# Altium project TrainingBoard_Dimmer_v1.0.PrjPcb
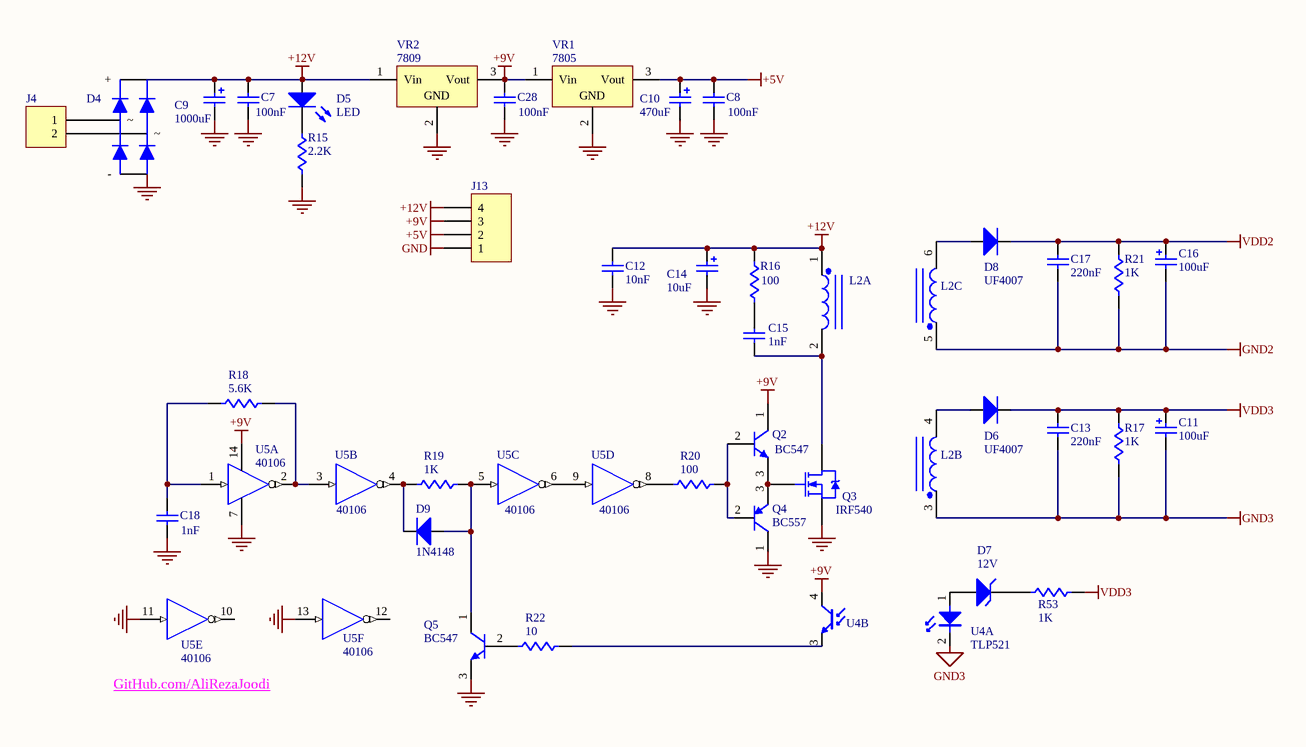
[diagram p0: Power Supply.SchDoc]
8 sheets, 63 parts. Net scope: flat (ports and power ports of the same name join across sheets).
Board file: PCB.PcbDoc
Sheets:
  Power Supply.SchDoc
  Key_Reset.SchDoc
  AVCC.SchDoc
  Programer Connectors_SPI.SchDoc
  Sounder_Buzzer.SchDoc
  Display_LCD16x2.SchDoc
  LM35.SchDoc
  PWM to DC.SchDoc

## Sheet Power Supply.SchDoc
size 241 x 134 mm; PageSetup: Record=PageOptions|CenterHorizontal=True|CenterVertical=True|PrintScale=0.71|XCorrection=1.00|YCorrection=1.00|PrintKind=1|BorderSize=5000000|LeftOffset=0|BottomOffset=0|Orientation=2|PaperLength=1000|PaperWidth=1000|Scale=100|PaperSource=15|PrintQuality=4000|MediaType=1|DitherType=10|PrintScaleMode=1|PaperKind=A4|PaperIndex=9

### Parts
(Parts that share a designator on the sheet are numbered #1, #2 ... from top to bottom, then left to right.)
C7  value 100nF  [CAPNTO2.54-3.05x1.78A]  (hidden comment: Cap)
C8  value 100nF  [CAPNTO2.54-3.05x1.78A]  (hidden comment: Cap)
C9  value 1000uF  [CAPPR5-10x12.5]  (hidden comment: Cap Pol1)
C10  value 470uF  [CAPPR5-10x12.5]  (hidden comment: Cap Pol1)
C11  value 100uF  [CAPPR2.5-6.3x5]  (hidden comment: Cap Pol1)
C12  value 10nF  [CAPNTO2.54-3.05x1.78A]  (hidden comment: Cap)
C13  value 220nF  [CAPNTO5.08-7.37x3.94]  (hidden comment: Cap)
C14  value 10uF  [CAPPR2.5-6.3x5]  (hidden comment: Cap Pol1)
C15  value 1nF  [CAPNTO2.54-3.56x2.03]  (hidden comment: Cap)
C16  value 100uF  [CAPPR2.5-6.3x5]  (hidden comment: Cap Pol1)
C17#1  value 220nF  [CAPNTO5.08-7.37x3.94]  (hidden comment: Cap)
C18  value 1nF  [CAPNTO2.54-3.05x1.78A]  (hidden comment: Cap)
C28  value 100nF  [CAPNTO2.54-3.05x1.78A]  (hidden comment: Cap)
D4  Bridge_1  [KBP]  (value not drawn)
D5  LED  [LED-5mm_Red]
D6  UF4007  [DIODE-0.4]
D7  value 12V  [DIODE-0.4]  (hidden comment: D Zener)
D8  UF4007  [DIODE-0.4]
D9  1N4148  [DIODE-0.4]
J4  Header 2  [Fonics_2PIN_1]  (value not drawn)
J13  Header 4  [Fonics_4PIN_1]  (value not drawn)
L2  Inductor 3  [INDUCTOR3]  (value not drawn)  (parts A,B,C of 3)
Q2  Device: BC547  [TO92C]  (hidden comment: NPN)
Q3  IRF540  [TO220V]
Q4  BC557  [TO92C]
Q5  value BC547  [TO92C]  (hidden comment: NPN)
R15  value 2.2K  [AXIAL-0.4]  (hidden comment: Res1)
R16  value 100  [AXIAL-0.4]  (hidden comment: Res1)
R17  value 1K  [AXIAL-0.4]  (hidden comment: Res1)
R18  value 5.6K  [AXIAL-0.4]  (hidden comment: Res1)
R19  value 1K  [AXIAL-0.4]  (hidden comment: Res1)
R20  value 100  [AXIAL-0.4]  (hidden comment: Res1)
R21  value 1K  [AXIAL-0.4]  (hidden comment: Res1)
R22  value 10  [AXIAL-0.4]  (hidden comment: Res1)
R53  value 1K  [AXIAL-0.4]  (hidden comment: Res1)
U4  value TLP521  [DIP-4]  (hidden comment: Optoisolator)  (parts A,B of 2)
U5  value 40106  [DIP14]  (hidden comment: U?)  (parts A,B,C,D,E,F of 6)
VR1  value 7805  [TO220V]  (hidden comment: Volt Reg)
VR2  value 7809  [TO220V]  (hidden comment: Volt Reg)

### Nets
+5V: C8.2 C10.1 J13.2 VR1.3(Vout)
+9V: C28.2 J13.3 Q2.1(C) U4.4(C) U5.14(VDD) VR1.1(Vin) VR2.3(Vout)
+12V: C7.2 C9.1 C12.2 C14.1 D4.3(+) D5.1(A) J13.4 L2.1 R16.1 VR2.1(Vin)
GND: C7.1 C8.1 C9.2 C10.2 C12.1 C14.2 C18.1 C28.1 D4.1(-) J13.1 Q3.3(S) Q4.1(C) Q5.3(E) R15.2 U5.7(VSS) U5.11(I) U5.13(I) VR1.2(GND) VR2.2(GND)
GND2: C16.2 C17#1.1 L2.5 R21.2
GND3: C11.2 C13.1 L2.3 R17.2 U4.2(K)
VDD2: C16.1 C17#1.2 D8.2(K) R21.1
VDD3: C11.1 C13.2 D6.2(K) R17.1 R53.1
NetC15_1: C15.1 L2.2 Q3.2(D)
NetC15_2: C15.2 R16.2
NetC18_2: C18.2 R18.2 U5.1(I)
NetD4_2: D4.2 J4.2
NetD4_4: D4.4 J4.1
NetD5_2: D5.2(K) R15.1
NetD6_1: D6.1(A) L2.4
NetD7_1: D7.1(A) U4.1(A)
NetD7_2: D7.2(K) R53.2
NetD8_1: D8.1(A) L2.6
NetD9_1: D9.1(A) Q5.1(C) R19.1 U5.5(I)
NetD9_2: D9.2(K) R19.2 U5.4(~{O})
NetQ2_2: Q2.2(B) Q4.2(B) R20.2
NetQ2_3: Q2.3(E) Q3.1(G) Q4.3(E)
NetQ5_2: Q5.2(B) R22.1
NetR18_1: R18.1 U5.2(~{O}) U5.3(I)
NetR20_1: R20.1 U5.8(~{O})
NetR22_2: R22.2 U4.3(E)
NetU5_6: U5.6(~{O}) U5.9(I)

Not connected (* = marked no-connect by the designer): U5 10(~{O}) 12(~{O})

### Notes on the sheet
- GitHub.com/AliRezaJoodi

### Library data of the parts
C7 C8 C12 C13 C15 C17#1 C18 C28 = Cap: Capacitor; Manufacturer: Generic Components; Class I: Passive; Published: 8-Jun-2000; Revision: July-2002: Re-released for DXP Platform.; Publisher: Altium Limited; Class II: Capacitor
C9-C11 C14 C16 = Cap Pol1: Polarized Capacitor (Radial); Manufacturer: Generic Components; Class I: Passive; Published: 8-Jun-2000; Revision: July-2002: Re-released for DXP Platform.; Publisher: Altium Limited; Class II: Capacitor
D4 = Bridge_1: Full Wave Diode Bridge; Manufacturer: Generic Components; Class I: Discrete; Class II: Rectifier - Bridge; Published: 8-Jun-2000; Revision: July-2002: Re-released for DXP Platform.; Publisher: Altium Limited
D5 = LED: Typical INFRARED GaAs LED; Manufacturer: Generic Components; Class I: Optoelectronic; Published: 8-Jun-2000; Revision: July-2002: Re-released for DXP Platform.; Publisher: Altium Limited; Class II: LED
D6 D8 D9 = Diode: Default Diode; Manufacturer: Generic Components; Class I: Discrete; Class II: Diode - Switching; Published: 8-Jun-2000; Revision: July-2002: Re-released for DXP Platform.; Publisher: Altium Limited
D7 = D Zener: Zener Diode; Manufacturer: Generic Components; Class I: Discrete; Class II: Diode - Zener; Published: 8-Jun-2000; Revision: July-2002: Re-released for DXP Platform.; Publisher: Altium Limited
J4 = Header 2: Header, 2-Pin; LatestRevisionDate: 17-Jul-2002; LatestRevisionNote: Re-released for DXP Platform.; Publisher: Altium Limited
J13 = Header 4: Header, 4-Pin; Manufacturer: Generic Components; Class I: Connector; Revision: July-2002: Re-released for DXP Platform.; Publisher: Altium Limited
Q2 = NPN: Silicon Bipolar Transistor; Package Reference: TO-92A
Q3 = IRFP141: 31A, 80V, 0.077 Ohm, N-Channel Power MOSFET; Note: Pin 2 (drain) is electrically connected to the case metal; Published: 8-Jun-2000; LatestRevisionDate: 17-Jul-2002; LatestRevisionNote: Re-released for DXP Platform.; DatasheetVersion: Jan-1998; PackageVersion: 1994; PackageReference: TO-247; Publisher: Altium Limited; PackageDescription: SIP with Mounting Hole; 3 Leads; Body 20.6 x 15.6 x 4.7 mm (typ); Pitch 5.56 mm; ComponentLink1Description: Manufacturer Link; ComponentLink1URL: http://www.intersil.com/cda/home/
Q4 = PNP: PNP Bipolar Transistor; Manufacturer: Generic Components; Class I: Discrete; Class II: BJT - Low Power; Published: 8-Jun-2000; Revision: July-2002: Re-released for DXP Platform.; Publisher: Altium Limited
Q5 = NPN: NPN Bipolar Transistor; Manufacturer: Generic Components; Class I: Discrete; Class II: BJT - Low Power; Published: 8-Jun-2000; Revision: July-2002: Re-released for DXP Platform.; Publisher: Altium Limited
R15-R22 R53 = Res1: Resistor; Manufacturer: Generic Components; Class I: Passive; Published: 8-Jun-2000; Revision: July-2002: Re-released for DXP Platform.; Publisher: Altium Limited; Class II: Resistor
U5 = 40106: Hex inverting Schmitt trigger, 14-Pin; Publisher: Altium Limited; ComponentLink1URL: http://www.nxp.com
VR1 VR2 = Volt Reg: Voltage Regulator; Manufacturer: Generic Components; Class I: Power Management; Published: 24-Mar-1999; Revision: July-2002: Re-released for DXP Platform.; Publisher: Altium Limited; Class II: Voltage Regulator
L2 = Inductor 3: Publisher: Altium Limited
U4 = Optoisolator: Publisher: Altium Limited

## Sheet Key_Reset.SchDoc
size 53 x 33 mm
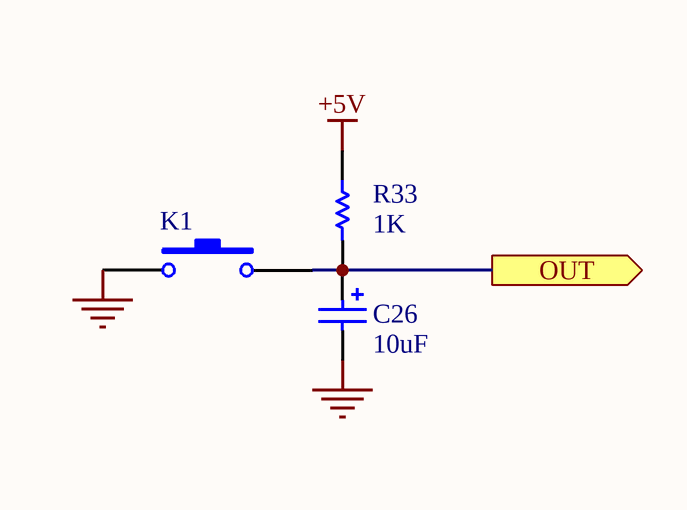
[diagram p1: Key_Reset.SchDoc]

### Parts
C26  value 10uF  [CAPPR2.5-6.3x5]  (hidden comment: Cap Pol1)
K1  SW-PB  [SPST-2_2]  (value not drawn)
R33  value 1K  [AXIAL-0.4]  (hidden comment: Res1)

### Ports
OUT (out)

### Nets
+5V: R33.1
GND: C26.2 K1.1
NetC1_1: C26.1 K1.2 R33.2 ; port OUT

### Library data of the parts
C26 = Cap Pol1: as C9 on sheet Power Supply; Published: 8-Jun-2000; Revision: July-2002: Re-released for DXP Platform.; Publisher: Altium Limited; Class II: Capacitor
K1 = SW-PB: Switch; Manufacturer: Generic Components; Published: 24-Mar-1999; Revision: July-2002: Re-released for DXP Platform.; Publisher: Altium Limited
R33 = Res1: as R15 on sheet Power Supply; Published: 8-Jun-2000; Revision: July-2002: Re-released for DXP Platform.; Publisher: Altium Limited; Class II: Resistor

## Sheet AVCC.SchDoc
size 60 x 25 mm
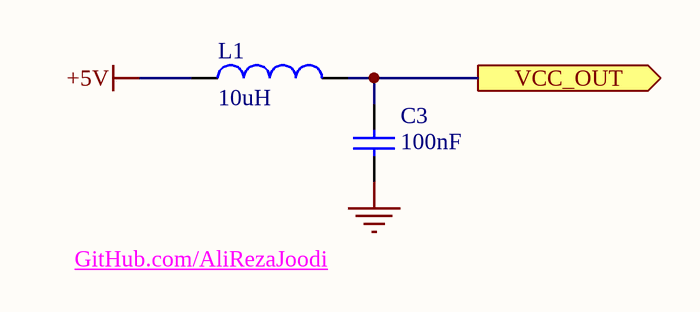
[diagram p2: AVCC.SchDoc]

### Parts
C3  value 100nF  [CAPNTO2.54-3.05x1.78A]  (hidden comment: Cap)
L1  value 10uH  [Inductor_1]  (hidden comment: Inductor)

### Ports
VCC_OUT (out)

### Nets
+5V: L1.1
GND: C3.2
NetC3_1: C3.1 L1.2 ; port VCC_OUT

### Notes on the sheet
- (near C3) GitHub.com/AliRezaJoodi

### Library data of the parts
C3 = Cap: as C7 on sheet Power Supply; Published: 8-Jun-2000; Revision: July-2002: Re-released for DXP Platform.; Publisher: Altium Limited; Class II: Capacitor
L1 = Inductor: Manufacturer: Generic Components; Class I: Passive; Published: 8-Jun-2000; Revision: July-2002: Re-released for DXP Platform.; Publisher: Altium Limited; Class II: Inductor; Supplier 1: Newark

## Sheet Programer Connectors_SPI.SchDoc
size 43 x 33 mm
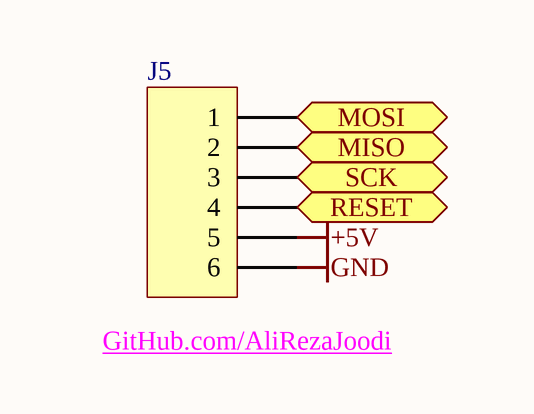
[diagram p3: Programer Connectors_SPI.SchDoc]

### Parts
J5  Header 6  [HDR1X6]  (value not drawn)

### Ports
MISO (out), MOSI (out), RESET (out), SCK (out)

### Nets
+5V: J5.5
GND: J5.6
NetJ5_1: J5.1 ; port MOSI
NetJ5_2: J5.2 ; port MISO
NetJ5_3: J5.3 ; port SCK
NetJ5_4: J5.4 ; port RESET

### Notes on the sheet
- (near J5) GitHub.com/AliRezaJoodi

### Library data of the parts
J5 = Header 6: Header, 6-Pin; LatestRevisionDate: 17-Jul-2002; LatestRevisionNote: Re-released for DXP Platform.; Publisher: Altium Limited

## Sheet Sounder_Buzzer.SchDoc
size 50 x 30 mm
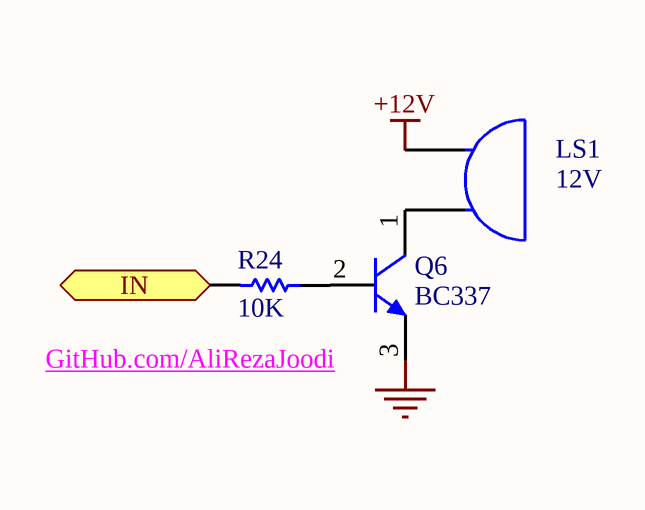
[diagram p4: Sounder_Buzzer.SchDoc]

### Parts
LS1  value 12V  [RB_7.62mm]  (hidden comment: Buzzer)
Q6  value BC337  [TO92C]  (hidden comment: NPN)
R24  value 10K  [AXIAL-0.4]  (hidden comment: Res1)

### Ports
IN (in)

### Nets
+12V: LS1.1(A)
GND: Q6.3(E)
NetLS1_2: LS1.2(B) Q6.1(C)
NetQ6_2: Q6.2(B) R24.1
NetR23_2: R24.2 ; port IN

### Notes on the sheet
- GitHub.com/AliRezaJoodi

### Library data of the parts
LS1 = Buzzer: Sounder; Manufacturer: Generic Components; Published: 24-Mar-1999; Revision: July-2002: Re-released for DXP Platform.; Publisher: Altium Limited
Q6 = NPN: as Q5 on sheet Power Supply; Published: 8-Jun-2000; Revision: July-2002: Re-released for DXP Platform.; Publisher: Altium Limited
R24 = Res1: Resistor; Published: 8-Jun-2000; LatestRevisionDate: 17-Jul-2002; LatestRevisionNote: Re-released for DXP Platform.; PackageReference: AXIAL-0.3; Publisher: Altium Limited

## Sheet Display_LCD16x2.SchDoc
size 99 x 81 mm
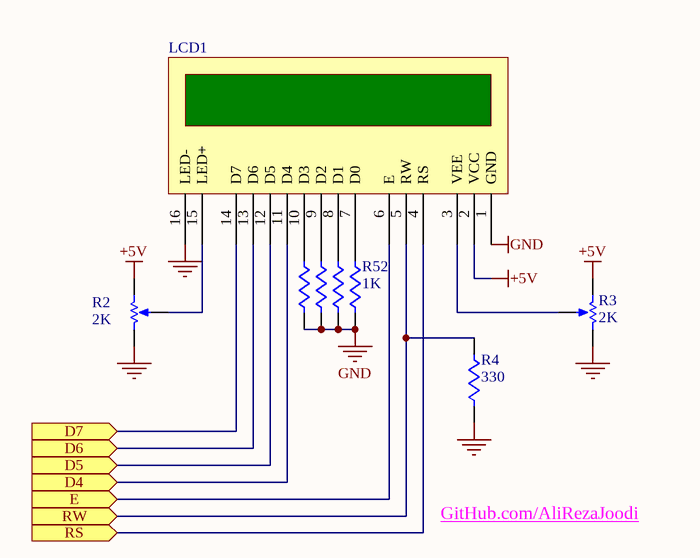
[diagram p5: Display_LCD16x2.SchDoc]

### Parts
LCD1  LCD_16*2  [LCD_2x16]  (value not drawn)
R2  value 2K  [VR8-5/5.6MM]  (hidden comment: RPot1)
R3  value 2K  [VR8-5/5.6MM]  (hidden comment: RPot1)
R4  value 330  [AXIAL-0.4]  (hidden comment: Res1)
R9  Res1  [AXIAL-0.4]  (value not drawn)
R50  Res1  [AXIAL-0.4]  (value not drawn)
R51  Res1  [AXIAL-0.4]  (value not drawn)
R52  value 1K  [AXIAL-0.4]  (hidden comment: Res1)

### Ports
D4 (in), D5 (in), D6 (in), D7 (in), E (in), RS (in), RW (in)

### Nets
+5V: LCD1.2(VCC) R2.1(TOP) R3.2(BOT)
GND: LCD1.1(GND) LCD1.16(LED-) R2.2(BOT) R3.1(TOP) R4.1 R9.1 R50.1 R51.1 R52.1
NetLCD1_3: LCD1.3(VEE) R3.3(TAP)
NetLCD1_4: LCD1.4(RS) ; port RS
NetLCD1_5: LCD1.5(RW) R4.2 ; port RW
NetLCD1_6: LCD1.6(E) ; port E
NetLCD1_7: LCD1.7(D0) R52.2
NetLCD1_8: LCD1.8(D1) R51.2
NetLCD1_9: LCD1.9(D2) R50.2
NetLCD1_10: LCD1.10(D3) R9.2
NetLCD1_11: LCD1.11(D4) ; port D4
NetLCD1_12: LCD1.12(D5) ; port D5
NetLCD1_13: LCD1.13(D6) ; port D6
NetLCD1_14: LCD1.14(D7) ; port D7
NetLCD1_15: LCD1.15(LED+) R2.3(TAP)

### Notes on the sheet
- GitHub.com/AliRezaJoodi

### Library data of the parts
R2 R3 = RPot1: Potentiometer; Manufacturer: Generic Components; Class I: Passive; Set Position: 0.5; Published: 8-Jun-2000; Revision: July-2002: Re-released for DXP Platform.; Publisher: Altium Limited; Class II: Potentiometer
R4 R52 = Res1: as R15 on sheet Power Supply; Published: 8-Jun-2000; Revision: July-2002: Re-released for DXP Platform.; Publisher: Altium Limited; Class II: Resistor
R9 R50 R51 = Res1: Resistor; Manufacturer: Generic Components; Class I: Passive; Value: 1K; Published: 8-Jun-2000; Revision: July-2002: Re-released for DXP Platform.; Publisher: Altium Limited; Class II: Resistor

## Sheet LM35.SchDoc
size 76 x 43 mm
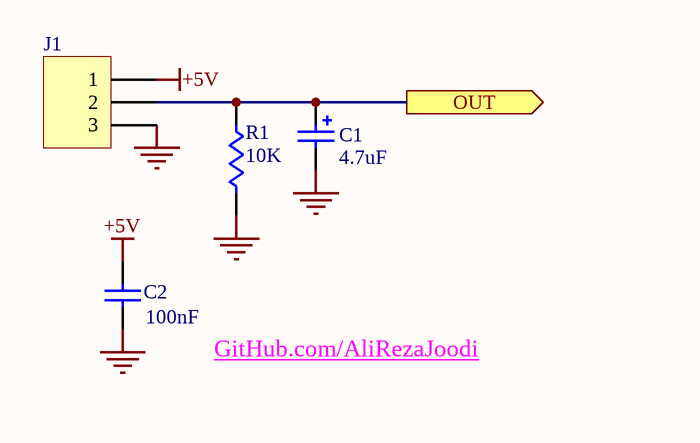
[diagram p6: LM35.SchDoc]

### Parts
C1  value 4.7uF  [CAPPR2.5-6.3x5]  (hidden comment: Capacitor)
C2  value 100nF  [CAPNTO2.54-3.05x1.78A]  (hidden comment: Capacitor)
J1  Header  [Fonics_3PIN_1]  (value not drawn)
R1  value 10K  [AXIAL-0.4]  (hidden comment: Resistor)

### Ports
OUT (out)

### Nets
+5V: C2.1 J1.1
GND: C1.2 C2.2 J1.3 R1.2
NetC1_1: C1.1 J1.2 R1.1 ; port OUT

### Notes on the sheet
- GitHub.com/AliRezaJoodi

### Library data of the parts
C1 = Cap Pol1: as C9 on sheet Power Supply; Published: 8-Jun-2000; Revision: July-2002: Re-released for DXP Platform.; Publisher: Altium Limited; Class II: Capacitor
C2 = Cap: Published: 8-Jun-2000; LatestRevisionDate: 17-Jul-2002; LatestRevisionNote: Re-released for DXP Platform.; PackageReference: RAD-0.3; Publisher: Altium Limited
J1 = Header 3: Header, 3-Pin; Manufacturer: Generic Components; Class I: Connector; Revision: July-2002: Re-released for DXP Platform.; Publisher: Altium Limited
R1 = Res1: Manufacturer: Generic Components; Class I: Passive; Published: 8-Jun-2000; Revision: July-2002: Re-released for DXP Platform.; Publisher: Altium Limited; Class II: Resistor

## Sheet PWM to DC.SchDoc
size 68 x 27 mm
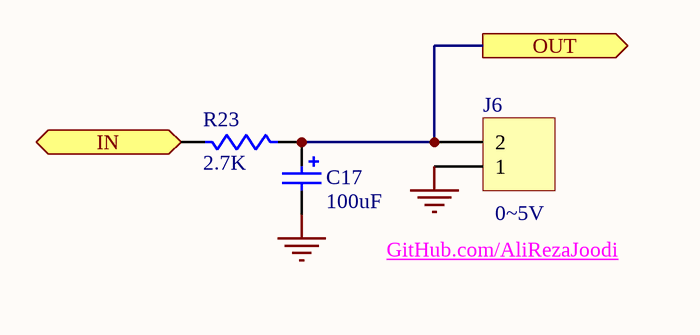
[diagram p7: PWM to DC.SchDoc]

### Parts
(Parts that share a designator on the sheet are numbered #1, #2 ... from top to bottom, then left to right.)
C17#2  value 100uF  [CAPPR2.5-6.3x5]  (hidden comment: C17)
J6  J6  [Fonics_2PIN_1]  (value not drawn)
R23  value 2.7K  [AXIAL-0.4]  (hidden comment: R23)

### Ports
IN (in), OUT (out)

### Nets
GND: C17#2.2 J6.1
NetC1_1: C17#2.1 J6.2 R23.1 ; port OUT
NetR23_2: R23.2 ; port IN

### Notes on the sheet
- GitHub.com/AliRezaJoodi
- (near J6) 0~5V

### Library data of the parts
C17#2 = Cap Pol1: as C9 on sheet Power Supply; Published: 8-Jun-2000; Revision: July-2002: Re-released for DXP Platform.; Publisher: Altium Limited; Class II: Capacitor
J6 = Header 2: Header, 2-Pin; LatestRevisionDate: 17-Jul-2002; LatestRevisionNote: Re-released for DXP Platform.; Publisher: Altium Limited
R23 = Res1: as R15 on sheet Power Supply; Published: 8-Jun-2000; Revision: July-2002: Re-released for DXP Platform.; Publisher: Altium Limited; Class II: Resistor

## Nets that join several sheets
+5V: Power Supply (C8.2 C10.1 J13.2 VR1.3), Key_Reset (R33.1), AVCC (L1.1), Programer Connectors_SPI (J5.5), Display_LCD16x2 (LCD1.2 R2.1 R3.2), LM35 (C2.1 J1.1)
+12V: Power Supply (10 pins), Sounder_Buzzer (LS1.1)
GND: Power Supply (19 pins), Key_Reset (C26.2 K1.1), AVCC (C3.2), Programer Connectors_SPI (J5.6), Sounder_Buzzer (Q6.3), Display_LCD16x2 (9 pins), LM35 (C1.2 C2.2 J1.3 R1.2), PWM to DC (C17#2.2 J6.1)
NetC1_1: Key_Reset (C26.1 K1.2 R33.2), LM35 (C1.1 J1.2 R1.1), PWM to DC (C17#2.1 J6.2 R23.1)
NetR23_2: Sounder_Buzzer (R24.2), PWM to DC (R23.2)